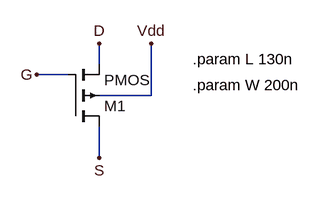
[diagram p0: schematic pmos.asc]
pmos.asc, the LTspice schematic file:
Version 4
SHEET 1 880 680
WIRE -80 -96 -80 -128
WIRE -128 -80 -176 -80
WIRE 0 -48 0 -128
WIRE 0 -48 -80 -48
WIRE -80 48 -80 0
FLAG -176 -80 G
FLAG -80 48 S
FLAG -80 -128 D
FLAG 0 -128 Vdd
SYMBOL pmos4 -128 0 M180
SYMATTR InstName M1
SYMATTR Value2 l={L} w={W}
TEXT 64 -104 Left 2 !.param L 130n
TEXT 64 -64 Left 2 !.param W 200n

The netlist it stands for:
* pmos.asc
M1 S G D Vdd PMOS l={L} w={W}
.model NMOS NMOS
.model PMOS PMOS
.lib standard.mos
.param L 130n
.param W 200n
.backanno
.end